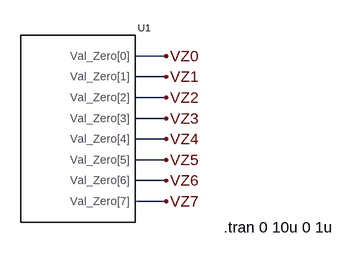
[diagram p0: schematic Val_Zero_Test.asc]
Val_Zero_Test.asc, the LTspice schematic file:
Version 4
SHEET 1 880 680
WIRE 80 144 32 144
WIRE 80 176 32 176
WIRE 80 208 32 208
WIRE 80 240 32 240
WIRE 80 272 32 272
WIRE 80 304 32 304
WIRE 80 336 32 336
WIRE 80 368 32 368
FLAG 80 144 VZ0
FLAG 80 176 VZ1
FLAG 80 208 VZ2
FLAG 80 240 VZ3
FLAG 80 272 VZ4
FLAG 80 304 VZ5
FLAG 80 336 VZ6
FLAG 80 368 VZ7
SYMBOL Val_Zero 16 208 R0
SYMATTR InstName U1
TEXT 168 408 Left 2 !.tran 0 10u 0 1u

The netlist it stands for:
* Val_Zero_Test.asc
XU1 VZ0 VZ1 VZ2 VZ3 VZ4 VZ5 VZ6 VZ7 Val_Zero  ; pins Val_Zero[0] Val_Zero[1] Val_Zero[2] Val_Zero[3] Val_Zero[4] Val_Zero[5] Val_Zero[6] Val_Zero[7]
.tran 0 10u 0 1u
.lib Val_Zero.sub
.backanno
.end